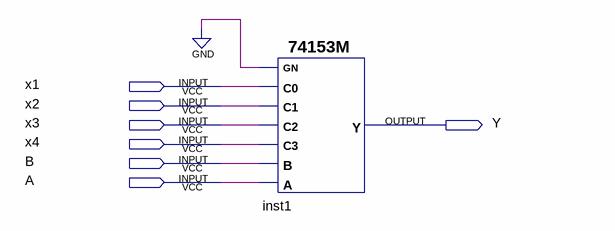
[diagram p0: schematic sheet]
// Quartus schematic scheme4.bdf as structural Verilog: 1 symbols, 7 pins
module scheme4 (
  input  x1,
  input  x2,
  input  x3,
  input  x4,
  input  B,
  input  A,
  output Y
);

  \74153M  inst1 (.A(A), .B(B), .C3(x4), .C2(x3), .C1(x2), .C0(x1), .GN(1'b0), .Y(Y));
endmodule
